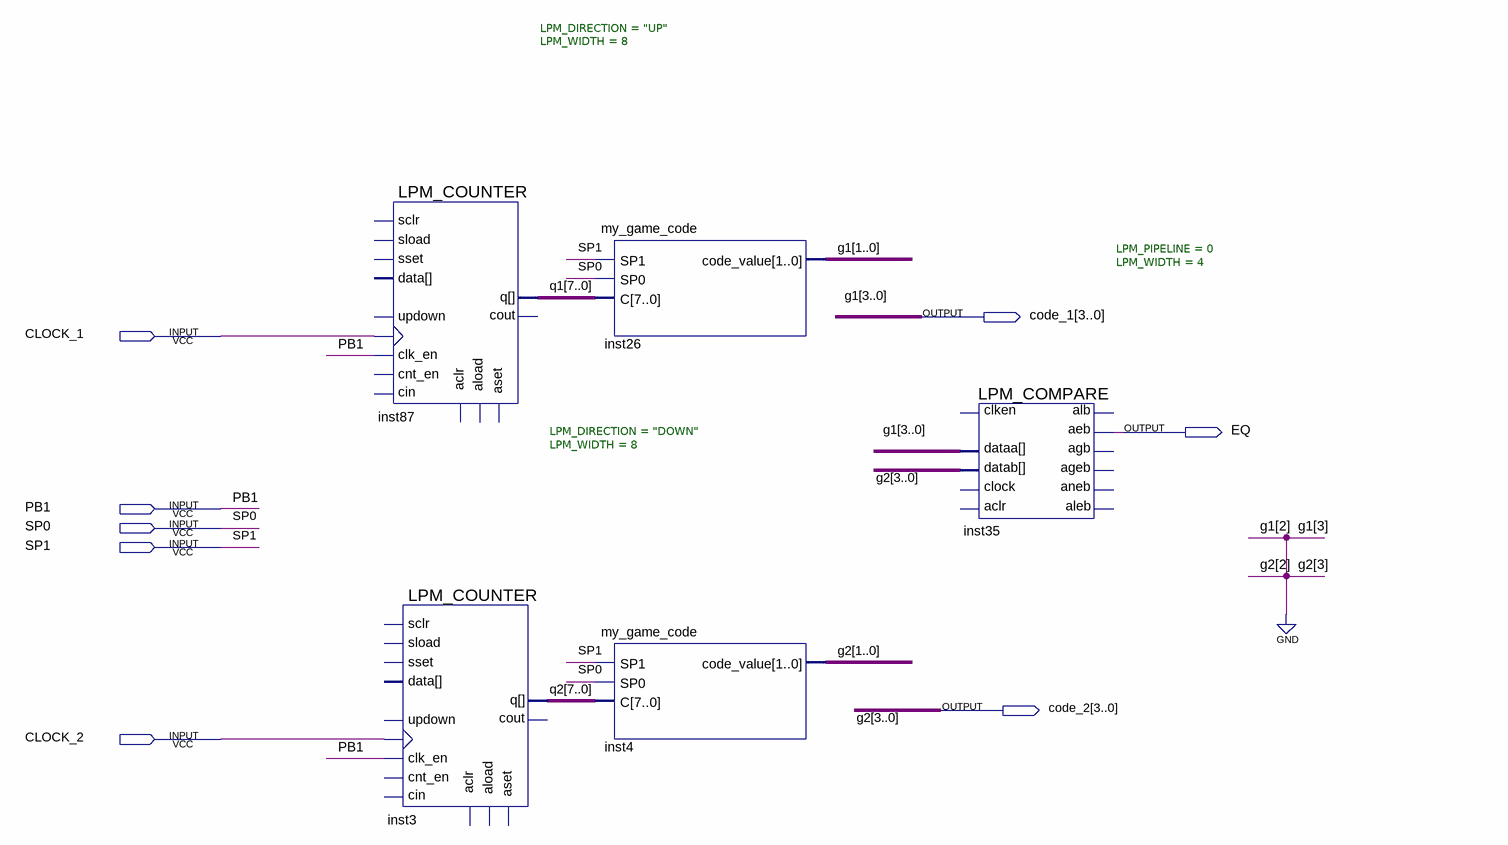
[diagram p0: schematic sheet]
// Quartus schematic LABblock.bdf as structural Verilog: 5 symbols, 8 pins
module LABblock (
  input  CLOCK_1,
  input  PB1,
  input  SP0,
  input  SP1,
  input  CLOCK_2,
  output [3:0] code_1,
  output EQ,
  output [3:0] code_2
);

  wire [7:0] q1, q2;

  LPM_COUNTER #(.LPM_DIRECTION("UP"), .LPM_WIDTH(8)) inst87 (
    .clock(CLOCK_1), .clk_en(PB1), .q(q1));  // open: sload, data, aload, aclr, aset, cin, sset, updown, cnt_en, sclr, cout
  LPM_COUNTER #(.LPM_DIRECTION("DOWN"), .LPM_WIDTH(8)) inst3 (
    .clock(CLOCK_2), .clk_en(PB1), .q(q2));  // open: sload, data, aload, aclr, aset, cin, sset, updown, cnt_en, sclr, cout
  my_game_code inst26 (.SP1(SP1), .SP0(SP0), .C(q1), .code_value(code_1[1:0]));
  my_game_code inst4 (.SP1(SP1), .SP0(SP0), .C(q2), .code_value(code_2[1:0]));
  LPM_COMPARE #(.LPM_PIPELINE(0), .LPM_WIDTH(4)) inst35 (
    .dataa({2'b00, code_1[1:0]}), .datab({2'b00, code_2[1:0]}), .aeb(EQ));  // open: clock, aclr, clken, aleb, agb, aneb, ageb, alb

  assign code_1[3:2] = 2'b00;
  assign code_2[3:2] = 2'b00;

  // Other names for the same wires on the sheet: g1[1:0] = code_1[1:0]; g2[1:0] = code_2[1:0]
endmodule
